# Altium schematic sheet MCU.SchDoc: MCU
size A4
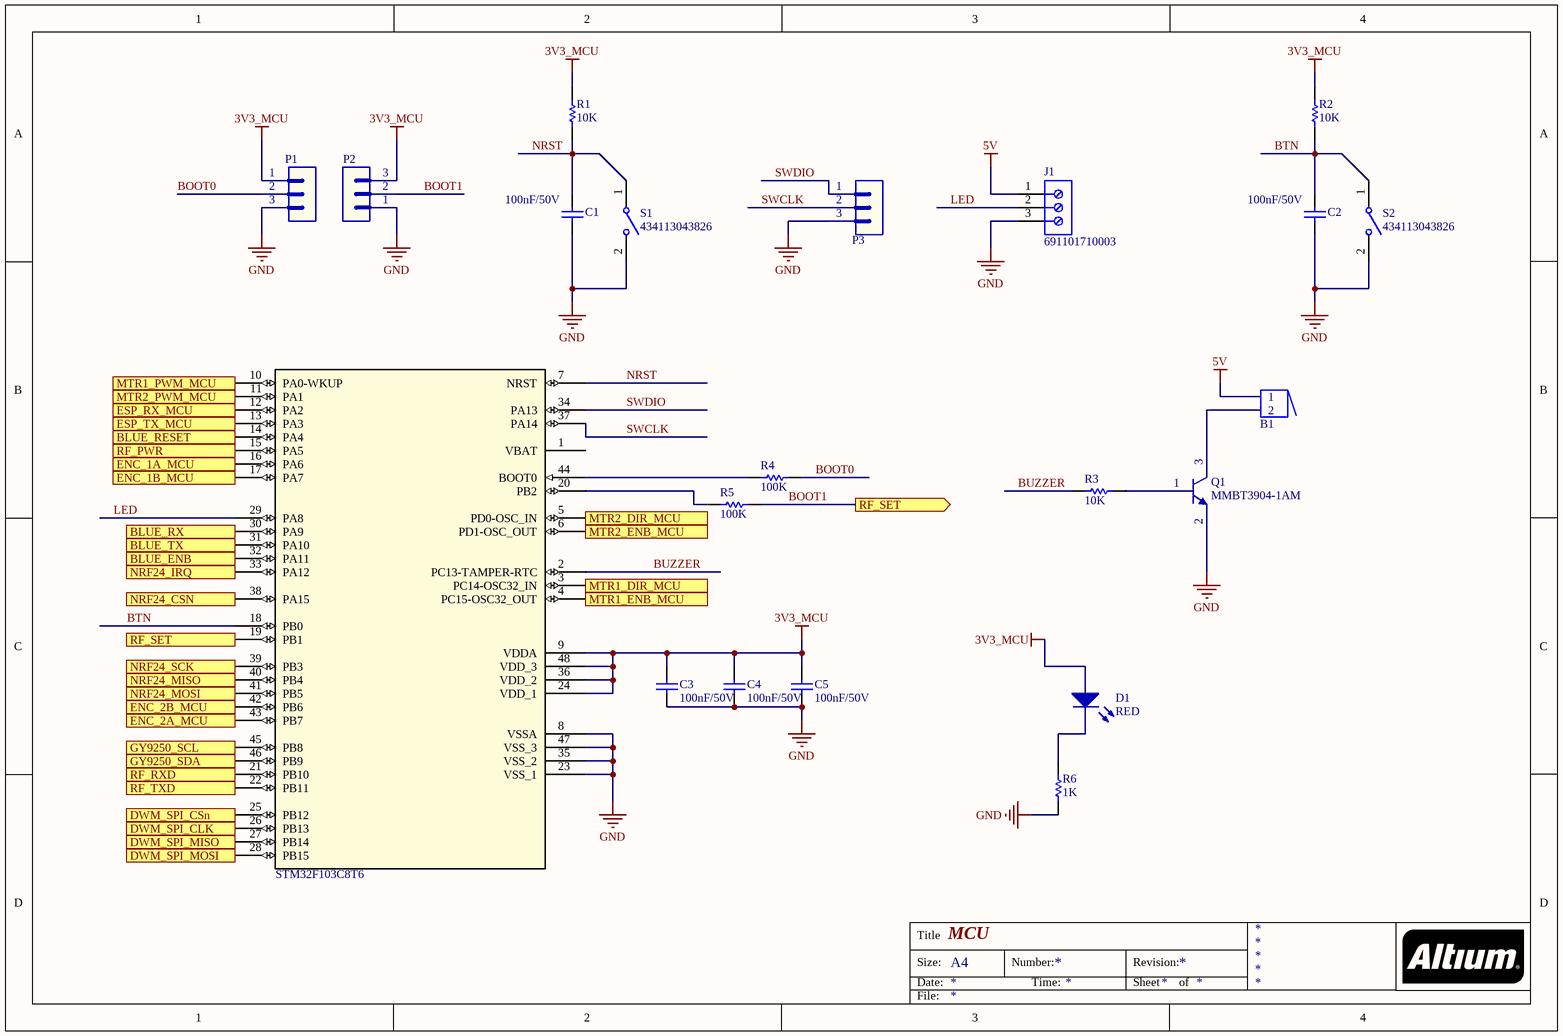
[diagram p0: MCU.SchDoc]

## Parts
?  STM32F103C8T6  [STM32]
B1  Buzzer  [BUZZER]  (value not drawn)
C1  value 100nF/50V  [CAP-SM-0805]  (hidden comment: Cap-1nF-50V-0805)
C2  value 100nF/50V  [CAP-SM-0805]  (hidden comment: Cap-1nF-50V-0805)
C3  value 100nF/50V  [CAP-SM-0805]  (hidden comment: Cap-100pF-50V-0805)
C4  value 100nF/50V  [CAP-SM-0805]  (hidden comment: Cap-100pF-50V-0805)
C5  value 100nF/50V  [CAP-SM-0805]  (hidden comment: Cap-100pF-50V-0805)
D1  RED  [LED_0805_Blue]
J1  691101710003  [691101710003]
P1  Header 3  [JP3]  (value not drawn)
P2  Header 3  [JP3]  (value not drawn)
P3  Header 3  [JP3]  (value not drawn)
Q1  MMBT3904-1AM  [SOT23_NEX]
R1  value 10K  [RES-SM-0805]  (hidden comment: Res-0-0805)
R2  value 10K  [RES-SM-0805]  (hidden comment: Res-0-0805)
R3  value 10K  [RES-SM-0805]  (hidden comment: Res-0-0805)
R4  value 100K  [RES-SM-0805]  (hidden comment: Res-0-0805)
R5  value 100K  [RES-SM-0805]  (hidden comment: Res-0-0805)
R6  value 1K  [RES-SM-0805]  (hidden comment: Res-0-0805)
S1  434113043826  [434113043826]
S2  434113043826  [434113043826]

## Ports
BLUE_ENB (out), BLUE_RESET (out), BLUE_RX (out), BLUE_TX (in), DWM_SPI_CLK (out), DWM_SPI_CSn (out), DWM_SPI_MISO (in), DWM_SPI_MOSI (out), ENC_1A_MCU (in), ENC_1B_MCU (in), ENC_2A_MCU (in), ENC_2B_MCU (in), ESP_RX_MCU (out), ESP_TX_MCU (in), GY9250_SCL (out), GY9250_SDA (out), MTR1_DIR_MCU (out), MTR1_ENB_MCU (out), MTR1_PWM_MCU (out), MTR2_DIR_MCU (out), MTR2_ENB_MCU (out), MTR2_PWM_MCU (out), NRF24_CSN (out), NRF24_IRQ (in), NRF24_MISO (in), NRF24_MOSI (out), NRF24_SCK (out), RF_PWR (out), RF_RXD (out), RF_SET (out), RF_TXD (in)

## Nets
3V3_MCU: ?.9(VDDA) ?.24(VDD_1) ?.36(VDD_2) ?.48(VDD_3) C3.1 C4.1 C5.1 D1.1(A) P1.1 P2.3 R1.2 R2.2
5V: B1.1 J1.1
GND: ?.8(VSSA) ?.23(VSS_1) ?.35(VSS_2) ?.47(VSS_3) C1.1 C2.1 C3.2 C4.2 C5.2 J1.3 P1.3 P2.1 P3.3 Q1.2(E) R6.1 S1.2 S2.2
BLUE_ENB: ?.32(PA11) ; port BLUE_ENB
BLUE_RESET: ?.14(PA4) ; port BLUE_RESET
BLUE_RX: ?.30(PA9) ; port BLUE_RX
BLUE_TX: ?.31(PA10) ; port BLUE_TX
BOOT0: P1.2 R4.2
BOOT1: ?.19(PB1) P2.2 R5.2 ; port RF_SET
BTN: ?.18(PB0) C2.2 R2.1 S2.1
BUZZER: ?.2(PC13-TAMPER-RTC) R3.2
DWM_SPI_CLK: ?.26(PB13) ; port DWM_SPI_CLK
DWM_SPI_CSn: ?.25(PB12) ; port DWM_SPI_CSn
DWM_SPI_MISO: ?.27(PB14) ; port DWM_SPI_MISO
DWM_SPI_MOSI: ?.28(PB15) ; port DWM_SPI_MOSI
ENC_1A_MCU: ?.16(PA6) ; port ENC_1A_MCU
ENC_1B_MCU: ?.17(PA7) ; port ENC_1B_MCU
ENC_2A_MCU: ?.43(PB7) ; port ENC_2A_MCU
ENC_2B_MCU: ?.42(PB6) ; port ENC_2B_MCU
ESP_RX_MCU: ?.12(PA2) ; port ESP_RX_MCU
ESP_TX_MCU: ?.13(PA3) ; port ESP_TX_MCU
GY9250_SCL: ?.45(PB8) ; port GY9250_SCL
GY9250_SDA: ?.46(PB9) ; port GY9250_SDA
LED: ?.29(PA8) J1.2
MTR1_DIR_MCU: ?.3(PC14-OSC32_IN) ; port MTR1_DIR_MCU
MTR1_ENB_MCU: ?.4(PC15-OSC32_OUT) ; port MTR1_ENB_MCU
MTR1_PWM_MCU: ?.10(PA0-WKUP) ; port MTR1_PWM_MCU
MTR2_DIR_MCU: ?.5(PD0-OSC_IN) ; port MTR2_DIR_MCU
MTR2_ENB_MCU: ?.6(PD1-OSC_OUT) ; port MTR2_ENB_MCU
MTR2_PWM_MCU: ?.11(PA1) ; port MTR2_PWM_MCU
NRF24_CSN: ?.38(PA15) ; port NRF24_CSN
NRF24_IRQ: ?.33(PA12) ; port NRF24_IRQ
NRF24_MISO: ?.40(PB4) ; port NRF24_MISO
NRF24_MOSI: ?.41(PB5) ; port NRF24_MOSI
NRF24_SCK: ?.39(PB3) ; port NRF24_SCK
NRST: ?.7(NRST) C1.2 R1.1 S1.1
RF_PWR: ?.15(PA5) ; port RF_PWR
RF_RXD: ?.21(PB10) ; port RF_RXD
RF_TXD: ?.22(PB11) ; port RF_TXD
SWCLK: ?.37(PA14) P3.2
SWDIO: ?.34(PA13) P3.1
Net?_20: ?.20(PB2) R5.1
Net?_44: ?.44(BOOT0) R4.1
NetB1_2: B1.2 Q1.3(C)
NetD1_2: D1.2(K) R6.2
NetQ1_1: Q1.1(B) R3.1

Not connected (* = marked no-connect by the designer): ? 1(VBAT)

## Notes on the sheet
- Title
- Size:
- Date:
- A4
- Number:
- Time:
- Revision:
- Sheet
- of
- File:

## Library data of the parts
? = STM32F103C8T6: No Description Available; SourceLibrary: StMicro_2011-06-07; Built_By: EMA_UL_Team; Vendor: STMicroelectronics; Manufacturer_Part_Number: STM32F103C8T6; Copyright: Copyright (C) 2018 Accelerated Designs. All rights reserved; RefDes: RefDes; Type: DEV
C1 C2 = Cap-1nF-50V-0805: CAP CER 1000PF 100V X7R 0805; Manufacturer: Johanson Dielectrics Inc.; Manufacturer Part Number: 101X15W102MV4E; Local Supplier: thegioiic; Local Supplier Link: https://thegioiic.com/products/tu-1nf-50v-0805; Supplier 1: Digikey; Supplier 1 Link: https://www.digikey.com/product-detail/en/johanson-dielectrics-inc/101X15W102MV4E/709-1335-1-ND/2327235; Supplier 1 Part Number: 709-1335-1-ND
C3-C5 = Cap-100pF-50V-0805: CAP CER 100PF 50V C0G/NP0 0805; Manufacturer: KEMET; Manufacturer Part Number: C0805C101J5GACTU; Local Supplier: thegioiic; Local Supplier Link: https://thegioiic.com/products/tu-100pf-50v-0805; Supplier 1: Digikey; Supplier 1 Part Number: 399-1122-1-ND; Supplier 1 Link: https://www.digikey.com/product-detail/en/kemet/C0805C101J5GACTU/399-1122-1-ND/411397
D1 = LED
J1 = 691101710003: WR-TBL Serie 101 Horizontal Entry Modular, Pressure Clamp, pitch 5mm, 3p; Compliance: Lead free / RoHS; Modularity: Yes; PCB/Cable/Panel: PCB; Pin Number: 3; Rated Current [UL]: 16A; Working Voltage [UL]: 250VAC; ComponentLink1Description: Manufacturer; ComponentLink1URL: http://www.we-online.de; ComponentLink2URL: https://katalog.we-online.de/em/datasheet/691101710003.pdf; ComponentLink2Description: Datasheet; Mounting Technology: THT; Part Number: 691101710003; Packaging: Box; Operating Temperature: -40 to +105degC; Pitch: 5mm; Published Date: October 2019; Type: Horizontal; Publisher: Wurth Elektronik; Application: Pressure Clamp
P1-P3 = Header 3: Header, 3-Pin; LatestRevisionDate: 17-Jul-2002; LatestRevisionNote: Re-released for DXP Platform.; Publisher: Altium Limited
R1-R6 = Res-0-0805: RES 0 OHM JUMPER 0805; Manufacturer: Vishay Dale; Manufacturer Part Number: WSL080500000ZEA9; Local Supplier: thegioiic; Local Supplier Link: https://thegioiic.com/products/dien-tro-0-ohm-0805-5; Supplier 1: Digikey; Supplier 1 Link: https://www.digikey.com/product-detail/en/vishay-dale/WSL080500000ZEA9/541-3928-1-ND/7423223; Supplier 1 Part Number: 541-3928-1-ND
S1 S2 = 434113043826: WS-TASV J-Bend SMT Tact Switch 6x3.5mm, height 4.3mm, 260gf; Rated Voltage: 12VDC; Rated Current: 50mA; Washable: No; ComponentLink1Description: Manufacturer; ComponentLink1URL: http://www.we-online.de; ComponentLink2Description: Datasheet; ComponentLink2URL: https://katalog.we-online.com/em/datasheet/434113043826.pdf; Operating Temperature: -40 to +85degC; Part Number: 434113043826; Published Date: September 2019; Contact Material: Stainless Steel; Height: 4.3mm; Mounting Technology: SMT; Contact Plating: Silver; Operation Force: 260gf; Packaging: Tape and Reel; Terminal Material: Copper Alloy; Publisher: Wurth Elektronik; Terminal Plating: Silver